# Altium schematic sheet 4_PCConnection.SchDoc
size A3; DocumentNumber: 4; SheetNumber: 4; SheetTotal: 6
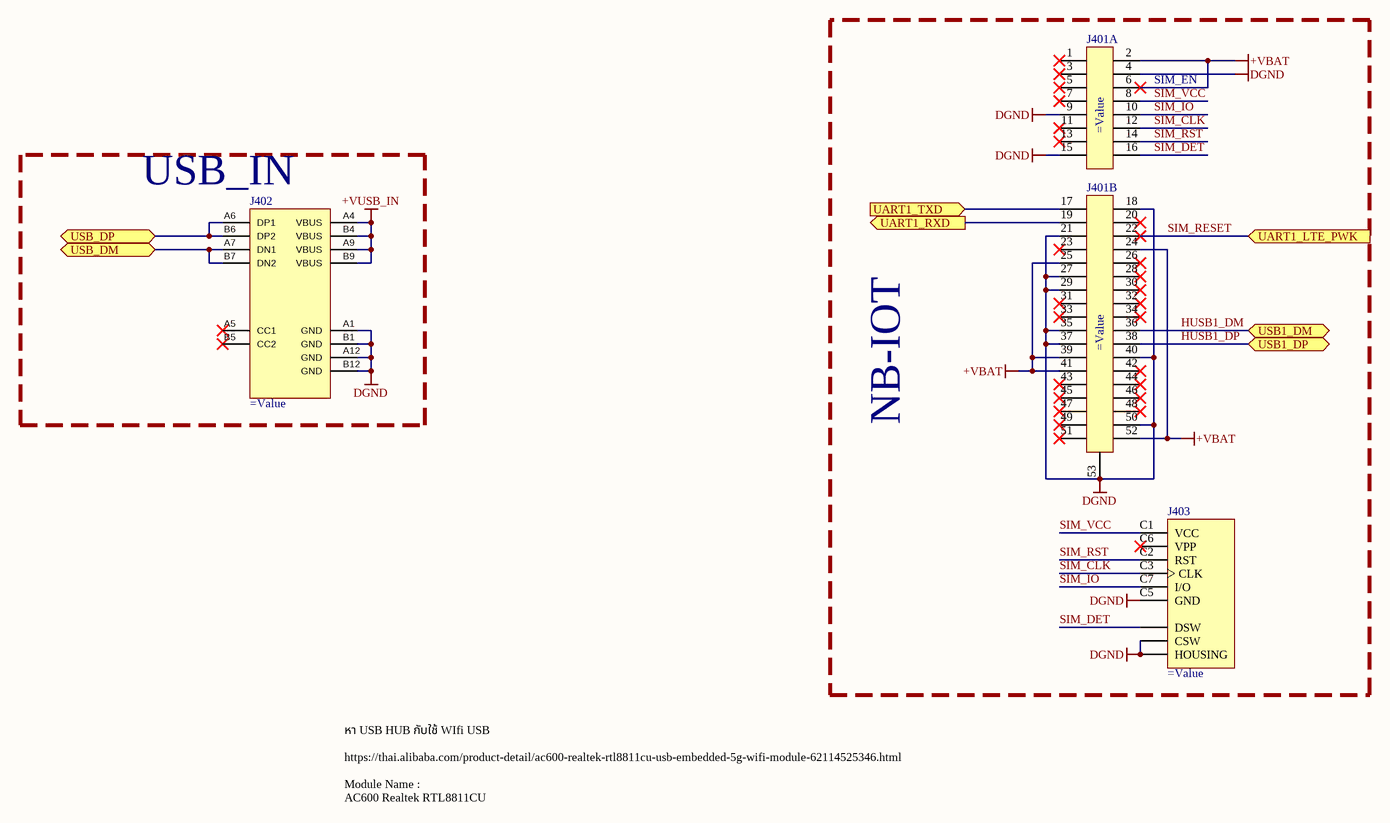
[diagram p0: 4_PCConnection.SchDoc]

## Parts
J401  (no value)  [TE_2041119-1]  (parts A,B of 2)
J402  (no value)  [216989-0001_MOL_2169890001]
J403  (no value)  [JAE_SF72S006VBDR2500]

## Blocks framed on the sheet
NB-IOT: J401 J403
USB_IN: J402

## Ports
UART1_LTE_PWK (in), UART1_RXD (out), UART1_TXD (in), USB1_DM (bidir), USB1_DP (bidir), USB_DM (bidir), USB_DP (bidir)

## Nets
+VBAT: J401.2 J401.6 J401.24 J401.25 J401.39 J401.41 J401.52
+VUSB_IN: J402.A4(VBUS) J402.A9(VBUS) J402.B4(VBUS) J402.B9(VBUS)
DGND: J401.4 J401.9 J401.15 J401.18 J401.21 J401.27 J401.29 J401.35 J401.37 J401.40 J401.50 J401.53 J402.A1(GND) J402.A12(GND) J402.B1(GND) J402.B12(GND) J403.C5(GND) J403.CSW J403.SH(HOUSING)
HUSB1_DM: J401.36 ; port USB1_DM
HUSB1_DP: J401.38 ; port USB1_DP
SIM_CLK: J401.12 J403.C3(CLK)
SIM_DET: J401.16 J403.DSW
SIM_IO: J401.10 J403.C7(I/O)
SIM_RESET: J401.22 ; port UART1_LTE_PWK
SIM_RST: J401.14 J403.C2(RST)
SIM_VCC: J401.8 J403.C1(VCC)
UART1_RXD: J401.19 ; port UART1_RXD
UART1_TXD: J401.17 ; port UART1_TXD
USB_DM: J402.A7(DN1) J402.B7(DN2) ; port USB_DM
USB_DP: J402.A6(DP1) J402.B6(DP2) ; port USB_DP

Not connected (* = marked no-connect by the designer): J401 1* 3* 5* 7* 11* 13* 20* 23* 26* 28* 30* 31* 32* 33* 34* 42* 43* 44* 45* 46* 47* 48* 49* 51*; J402 A5(CC1)* B5(CC2)*; J403 C6(VPP)*

## Notes on the sheet
- (near J401) SIM_EN
- หา USB HUB กับใช้ WIfi USB
  https://thai.alibaba.com/product-detail/ac600-realtek-rtl8811cu-usb-embedded-5g-wifi-module-62114525346.html
  Module Name :
  AC600 Realtek RTL8811CU
- Title :
- Revision :
- ผู้จัดทำ:
- Size:
- A3
- Time:
- ผู้เขียน:
- บริษัท ยูนิเวอร์แซล ยูทีลิตี้ส์ จำกัด (มหาชน) เลขที่ 1 อาคาร อีสท์วอเตอร์ ชั้น 18 ซอยวิภาวดีรังสิต 5 แขวงจอมพล เขตจตุจักร กรุงเทพฯ 10900
  Tel : +662-272-1688
  Fax :+662-2721690-1
- -
- Sheet:
- of
- ผู้อำนวยการ
- ผู้ตรวจสอบ:
- Number:
- กรรมการผู้จัดการ:
- File:

## Library data of the parts
J401 = CON_PCI-E-52P: CONN PCI EXP MINI FEMALE 52POS; PartNumber: 2041119-1; Manufacturer: TE Connectivity AMP Connectors; Value: 2041119-1; PartID: A108265CT-ND; PackageReference: *; Value2: *; Value3: *
J402 = CON_USBC_RIGHTANG: CONN RCPT USB2.0 TYPE C 24POS RA; PartNumber: 2169890001; Manufacturer: Molex; Value: 2169890001; Value2: KUSBX-SL-CS1N14-B; PartID: 900-2169890001CT-ND; PackageReference: *; Value3: *
J403 = CON_SIM_NanoSP: NANO SIM CARD CONNECTOR; PartNumber: SF72S006VBDR2500; Manufacturer: JAE Electronics; Value: SF72S006VBDR2500; PartID: 670-2967-1-ND; PackageReference: *; Value2: *; Value3: *